# Altium schematic sheet FAN_Control.SchDoc: Temperature
size 420 x 297 mm; Author: G.K.; CompanyName: WUT; DrawnBy: G.K.; Organization: WUT; Address1: Warsaw Univeristy of Technology; Address2: Nowowiejska 15/19; DocumentNumber: 6; SheetNumber: 6; SheetTotal: 6; EDA_Number: ARTIQ; Projet: Booster RF Power Amplifier; ModifiedBy: -; CreateDate: XX/XX/XXXX; CheckedDate: -; DivGrp: ISE; Designer: G.K.; ModifiedDate: -; ProjectName: Booster RF Power Amplifier
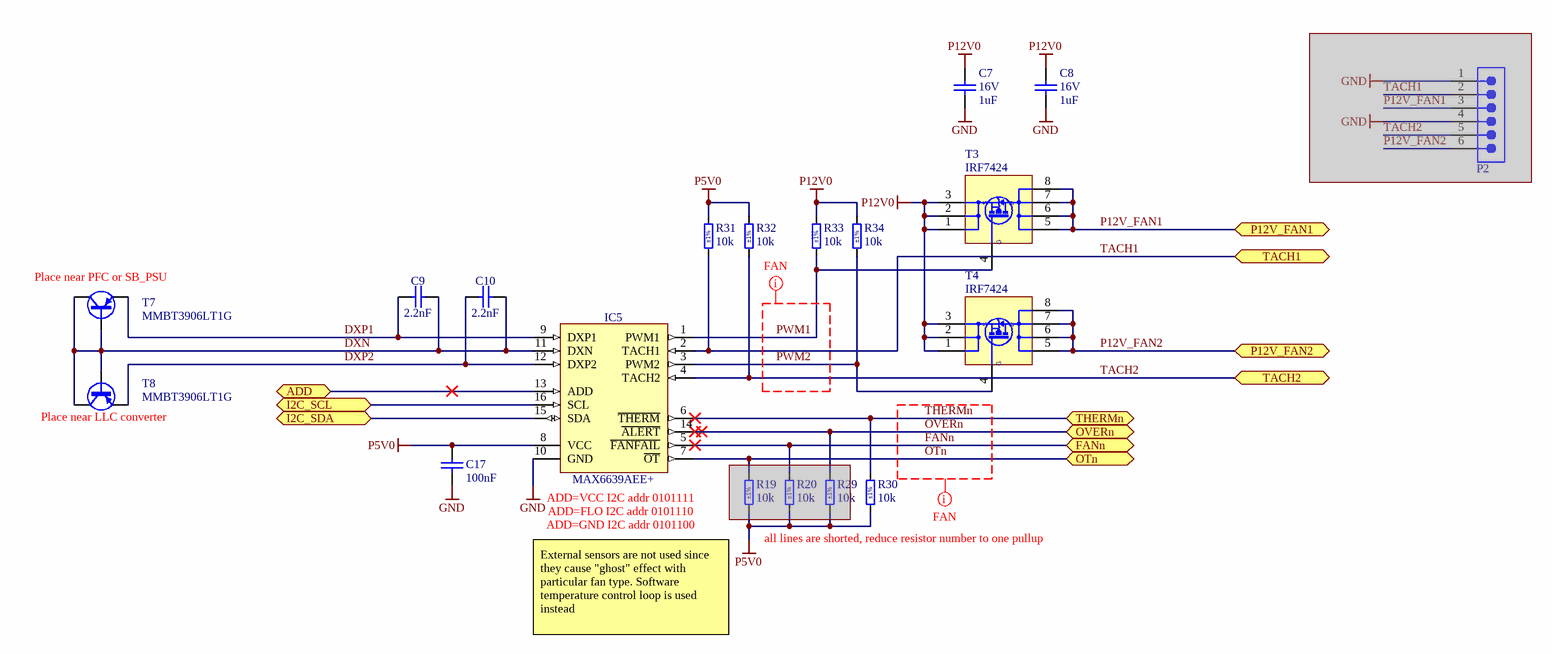
[diagram p0: FAN_Control.SchDoc]

## Parts
C7  1uF  Voltage: 16V  [CAPC1608X87N]
C8  1uF  Voltage: 16V  [CAPC1608X87N]
C9  2.2nF  [CAPC1608X87N]
C10  2.2nF  [CAPC1608X87N]
C17  100nF  [CAPC1608X87N]
IC5  MAX6639AEE+  [SOP63P600X175-16N]
P2  62000611121  [62000611121]  (value not drawn)  (masked out: inside a compile mask, not in the netlist)
R19  10k  Tolerance: ±1%  [RESC1608X55N]  (masked out: inside a compile mask, not in the netlist)
R20  10k  Tolerance: ±1%  [RESC1608X55N]  (masked out: inside a compile mask, not in the netlist)
R29  10k  Tolerance: ±1%  [RESC1608X55N]  (masked out: inside a compile mask, not in the netlist)
R30  10k  Tolerance: ±1%  [RESC1608X55N]
R31  10k  Tolerance: ±1%  [RESC1608X55N]
R32  10k  Tolerance: ±1%  [RESC1608X55N]
R33  10k  Tolerance: ±1%  [RESC1608X55N]
R34  10k  Tolerance: ±1%  [RESC1608X55N]
T3  IRF7424  [SOIC127P600X175-8N]
T4  IRF7424  [SOIC127P600X175-8N]
T7  MMBT3906LT1G  [SOT95P240X110-3N]
T8  MMBT3906LT1G  [SOT95P240X110-3N]

## Ports
ADD (bidir), FANn (bidir), I2C_SCL (bidir), I2C_SDA (bidir), OTn (bidir), OVERn (bidir), P12V_FAN1 (bidir), P12V_FAN2 (bidir), TACH1 (bidir), TACH2 (bidir), THERMn (bidir)

## Nets
GND: C7.1 C8.1 C17.1 IC5.10(GND)
P5V0: C17.2 IC5.8(VCC) R30.1 R31.2 R32.2
P12V0: C7.2 C8.2 R33.2 R34.2 T3.1(S) T3.2(S) T3.3(S) T4.1(S) T4.2(S) T4.3(S)
ADD: IC5.13(ADD) ; port ADD
DXN: C9.2 C10.2 IC5.11(DXN) T7.1(B) T7.3(C) T8.1(B) T8.3(C)
DXP1: C9.1 IC5.9(DXP1) T7.2(E)
DXP2: C10.1 IC5.12(DXP2) T8.2(E)
FANn: IC5.5(~{FANFAIL}) ; port FANn
I2C_SCL: IC5.16(SCL) ; port I2C_SCL
I2C_SDA: IC5.15(SDA) ; port I2C_SDA
OTn: IC5.7(~{OT}) ; port OTn
OVERn: IC5.14(~{ALERT}) ; port OVERn
P12V_FAN1: T3.5(D) T3.6(D) T3.7(D) T3.8(D) ; port P12V_FAN1
P12V_FAN2: T4.5(D) T4.6(D) T4.7(D) T4.8(D) ; port P12V_FAN2
PWM1: IC5.1(PWM1) R33.1 T3.4(G)
PWM2: IC5.3(PWM2) R34.1 T4.4(G)
TACH1: IC5.2(TACH1) R31.1 ; port TACH1
TACH2: IC5.4(TACH2) R32.1 ; port TACH2
THERMn: IC5.6(~{THERM}) R30.2 ; port THERMn

## Layout directives
net class FAN: FANn, OTn, OVERn, PWM1, PWM2, THERMn

## Notes on the sheet
- (near T7) Place near PFC or SB_PSU
- (near T8) Place near LLC converter
- (near IC5) ADD=VCC I2C addr 0101111
- ADD=FLO I2C addr 0101110
- ADD=GND I2C addr 0101100
- all lines are shorted, reduce resistor number to one pullup
- (near R19) External sensors are not used since they cause "ghost" effect with particular fan type. Software temperature control loop is used instead
- Project/Equipment
- Document
- Designer
- Drawn by
- Check.by
- File
- Last Mod.
- Print Date
- Sheet
- Size
- A3
- of
- Rev

## Library data of the parts
C7 C8 = CC0603_1UF_16V_10%_X7R: Non-polarised capacitor; Part Description: SMD Multilayer Chip Ceramic Capacitor; Manufacturer: GENERIC; Manufacturer1 Part Number: 223878615663; TC: X7R; Tolerance: ±10%; Part Number: CC0603_1UF_16V_10%_X7R; Component Kind: Standard; Component Type: Standard; Pin Count: 2; Value: 1uF; Status: None; Manufacturer Part Number: CC0603_1UF_16V_10%_X7R; Case: 0603; Mounted: Yes; Socket: No; SMD: Yes; Manufacturer1 Example: YAGEO PHYCOMP; Manufacturer1 ComponentHeight: 0.9mm; HelpURL: \\cern.ch\dfs\Applications\Altium\Datasheets\CC0603_X7R_PHYCOMP.pdf; Author: CERN DEM JLC; CreateDate: 03.12.2007; LatestRevisionDate: 17.04.2015; Sense: No
C9 C10 = CC0603_2.2NF_50V_10%_X7R: Non-polarised capacitor; Part Description: SMD Multilayer Chip Ceramic Capacitor; Manufacturer: GENERIC; Manufacturer1 Part Number: 223858615627; Voltage: 50V; TC: X7R; Tolerance: ±10%; Part Number: CC0603_2.2NF_50V_10%_X7R; Component Kind: Standard; Component Type: Standard; Pin Count: 2; Value: 2.2nF; Status: Preferred; Manufacturer Part Number: CC0603_2.2NF_50V_10%_X7R; Case: 0603; Mounted: Yes; Socket: No; SMD: Yes; Sense: No; Manufacturer1 Example: PHYCOMP; Manufacturer1 ComponentHeight: 0.87mm; HelpURL: \\cern.ch\dfs\Applications\Altium\Datasheets\CC0603_X7R_PHYCOMP.pdf; Author: CERN DEM JLC; CreateDate: 03.12.2007; LatestRevisionDate: 03.12.2007
C17 = CC0603_100NF_50V_10%_X5R: Non-polarised capacitor; Part Description: SMD Multilayer Chip Ceramic Capacitor; Manufacturer: GENERIC; Manufacturer1 Part Number: C1608X5R1H104K080; Voltage: 50V; TC: X5R; Tolerance: ±10%; Part Number: CC0603_100NF_50V_10%_X5R; Component Kind: Standard; Component Type: Standard; Pin Count: 2; Value: 100nF; Status: None; Manufacturer Part Number: CC0603_100NF_50V_10%_X5R; Case: 0603; Mounted: Yes; Socket: No; SMD: Yes; Sense: No; Manufacturer1 Example: TDK; Manufacturer1 ComponentHeight: 0.9mm; HelpURL: \\cern.ch\dfs\Applications\Altium\Datasheets\CC0603_X5R_TDK_C.pdf; Author: CERN DEM MR; CreateDate: 08.01.2016; LatestRevisionDate: 08.01.2016
IC5 = MAX6639AEE+: 2-Channel Temperature Monitor with Dual, Automatic, PWM Fan-Speed Controller; Manufacturer: MAXIM; PressFit: No; Bonding: No; Part Number: MAX6639AEE+; Component Kind: Standard; Component Type: Standard; Device: MAX6639AEE+; PackageDescription: SOP, 0.635mm Pitch; 16 Pin, 3.9mm W X 4.895mm L X 1.75mm H body, IPC Medium Density; Part Description: 2-Channel Temperature Monitor with Dual, Automatic, PWM Fan-Speed Controller; Manufacturer Part Number: MAX6639AEE; Pin Count: 16; Case: SSOP16; Mounted: Yes; Socket: No; SMD: Yes; ComponentHeight: 1.75mm; Author: CERN DEM JLC; HelpURL: \\cern.ch\dfs\Applications\Altium\Datasheets\MAX6639AEE+.pdf; CreateDate: 15.08.2012; LatestRevisionDate: 04.04.2022; Sense: No
P2 = 62000611121: WR-PHD Pin Header, THT, Vertical, pitch 2mm, 1 Row, 6P; Manufacturer: Wurth Elektronik; Contact Resistance: 20mOhm; Rated Current: 2A; Working Voltage: 200V; Withstanding Voltage: 500V; Manufacturer Part Number: 62000611121; Category: Board-to-Board Connectors; Match Code: WR-PHD; ComponentLink1Description: Website Link; ComponentLink1URL: https://www.we-online.com/redexpert/article/62000611121?ad; ComponentLink2Description: Datasheet Link; ComponentLink2URL: https://www.we-online.com/redexpert/spec/62000611121?ad; Mount: Through Hole; Operating Temperature Max: 105°C; Operating Temperature Min: -40°C; Packaging: Bag; Gender: Pin Header; Number of Pins: 6; Number of Rows: 1; Orientation: Vertical; Pitch: 2mm
R19 R20 R29-R34 = R0603_10K_1%_0.1W_100PPM: Resistor - 1%; Part Description: General Purpose Thick Film Chip Resistor; Manufacturer: GENERIC; Manufacturer1 Part Number: NRC06F1002TRF; Power: 0.1W; TC: ±100ppm/°C; PressFit: No; Part Number: R0603_10K_1%_0.1W_100PPM; Component Kind: Standard; Component Type: Standard; Pin Count: 2; Value: 10k; Status: Preferred; Manufacturer Part Number: R0603_10K_1%_0.1W_100PPM; Case: 0603; Mounted: Yes; Sense: No; Socket: No; SMD: Yes; Manufacturer1 Example: NIC COMPONENT; Manufacturer1 ComponentHeight: 0.55mm; HelpURL: \\cern.ch\dfs\Applications\Altium\Datasheets\R0603_NIC_NRC.pdf; Author: CERN DEM JLC; CreateDate: 03.12.2007; LatestRevisionDate: 13.03.2008
T3 T4 = IRF7424PBF: 30V 11A P-Channel HEXFET® Power MOSFET; Part Description: -30V -11A P-Channel HEXFET® Power MOSFET; Manufacturer: INTERNATIONAL RECTIFIER; PressFit: No; Bonding: No; Part Number: IRF7424PBF; Component Kind: Standard; Component Type: Standard; Device: IRF7424; PackageDescription: SOIC 8, Pitch 1.27mm - Body 4x5mm, IPC Medium Density; Manufacturer Part Number: IRF7424; Pin Count: 8; Case: SOIC8; Mounted: Yes; Socket: No; SMD: Yes; Sense: No; ComponentHeight: 1.75mm; HelpURL: \\cern.ch\dfs\Applications\Altium\Datasheets\IRF7424PBF.pdf; Author: CERN DEM JLC; CreateDate: 11.01.2011; LatestRevisionDate: 02.06.2022
T7 T8 = MMBT3906LT1G: PNP Transistor; Part Description: 40V 200mA PNP General Purpose Transistor; Manufacturer: ON SEMICONDUCTOR; PressFit: No; Bonding: No; Part Number: MMBT3906LT1G; Component Kind: Standard; Component Type: Standard; Device: MMBT3906LT1G; PackageDescription: SOT23, 0.95mm Pitch; 3 Pin, 1.40mm W X 3.00mm L X 1.10mm H body, IPC Medium Density; Manufacturer Part Number: MMBT3906L; Pin Count: 3; Case: SOT23-3; Mounted: Yes; Socket: No; SMD: Yes; Sense: No; ComponentHeight: 1.1mm; HelpURL: \\cern.ch\dfs\Applications\Altium\Datasheets\MMBT3906LT1G.pdf; Author: CERN DEM JLC; CreateDate: 29.03.2012; LatestRevisionDate: 25.05.2022